# Altium project IG_r2-0.PrjPCB
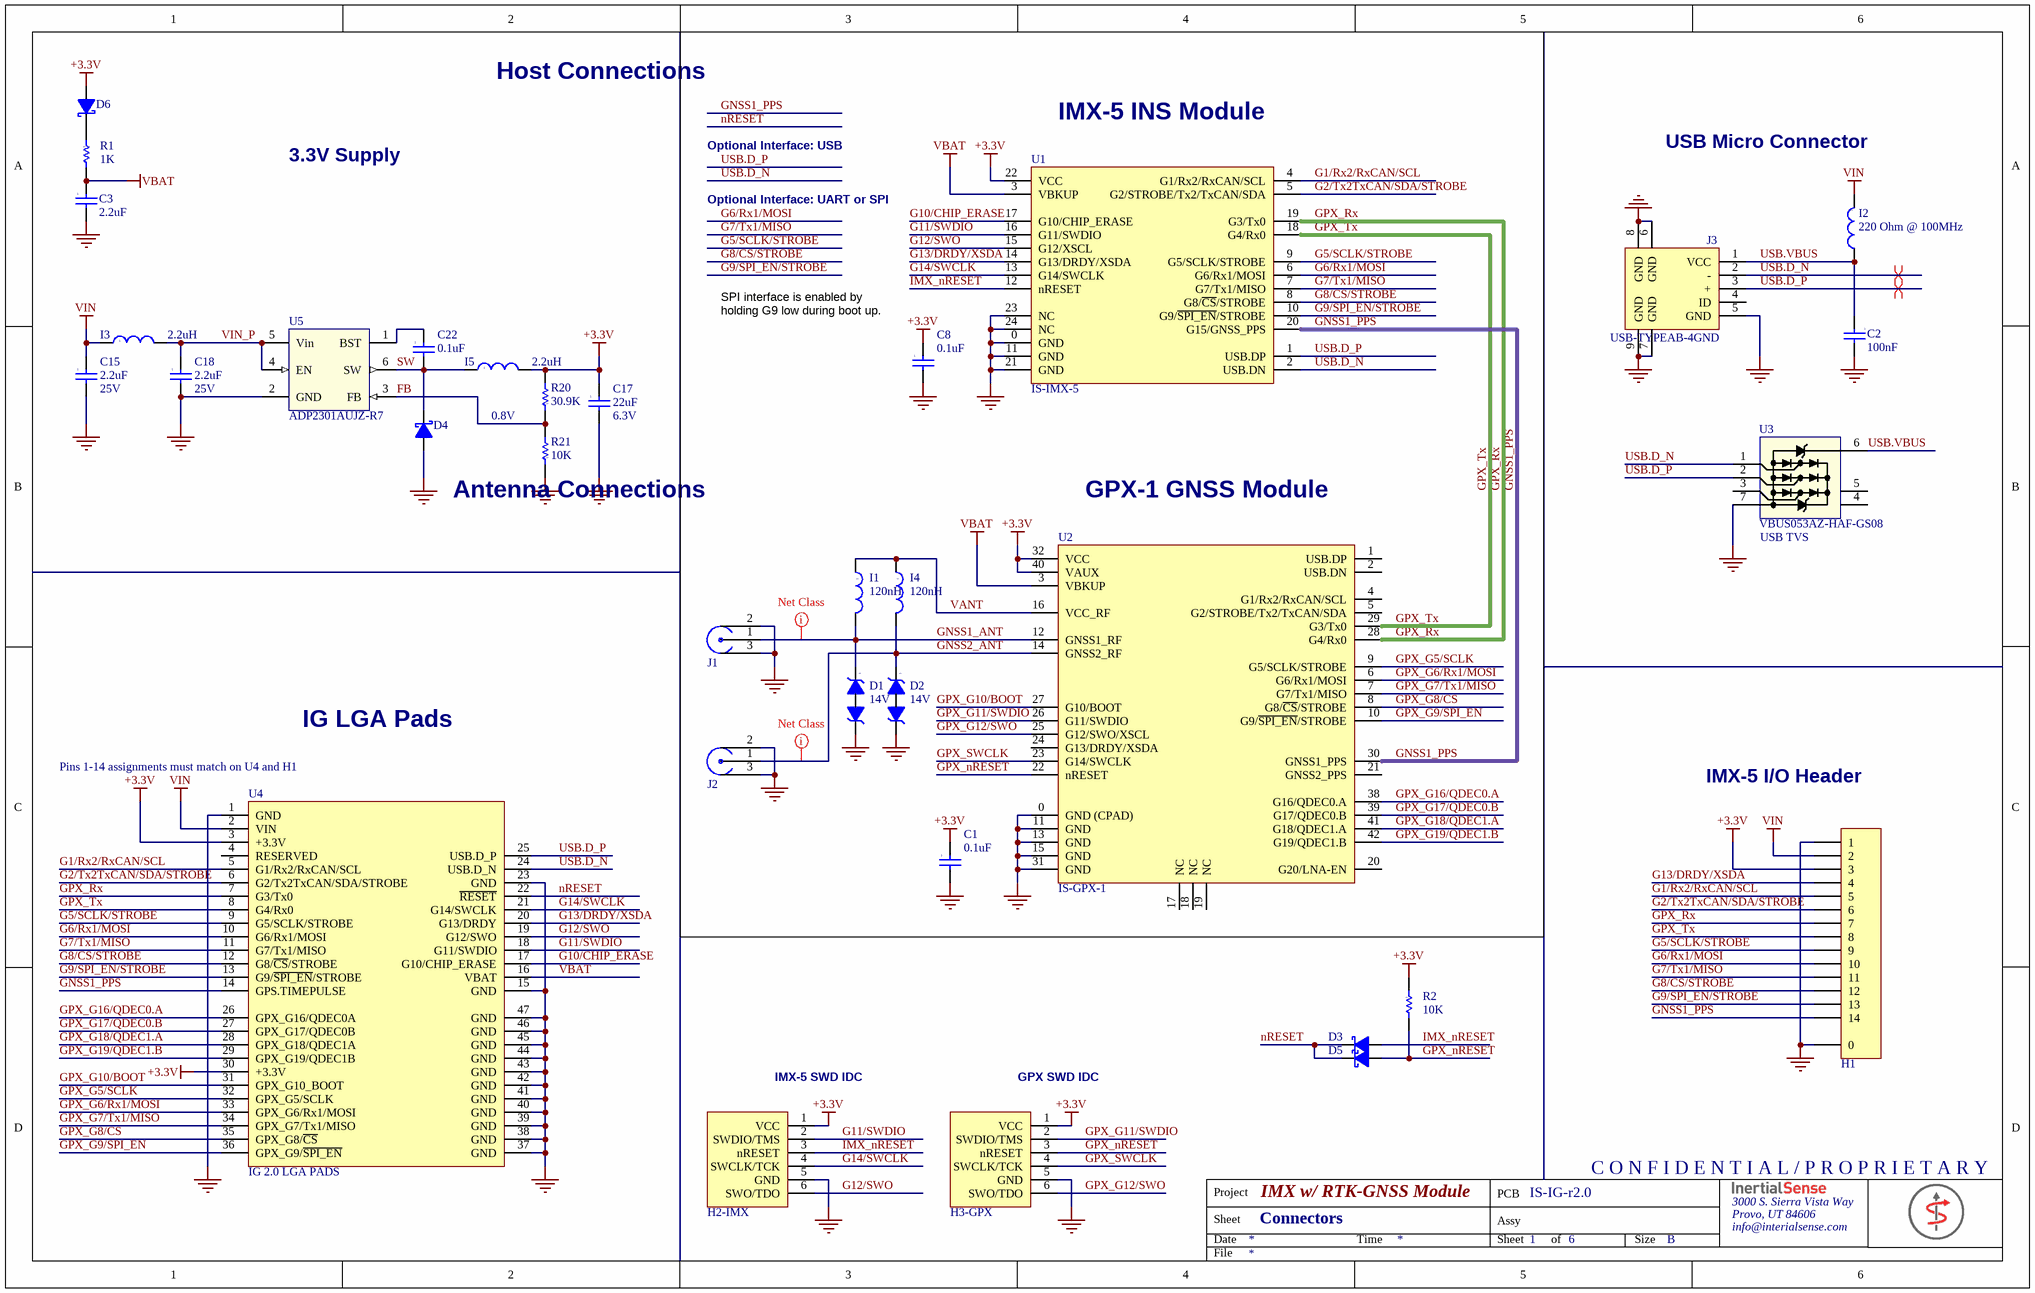
[diagram p0: Main.SchDoc]
AddressLine1: 3000 S. Sierra Vista Way; AddressLine2: Provo, UT 84606; AddressLine3: info@interialsense.com; Company: Inertial Sense, Inc.; PcbPartNumber: IS-IG-r2.0; PcbRevision: 2.0.2; ProjectTitle: IMX w/ RTK-GNSS Module
1 sheet, 34 parts. Net scope: global (net labels, ports and power ports of the same name join across sheets).
Board file: IG-2.PCBDOC

## Sheet Main.SchDoc: Connectors
size B; DocumentNumber: 1; SheetNumber: 1; SheetTotal: 6

### Parts
C1  value 0.1uF  [0402]  (hidden comment: Cap)
C2  value 100nF  [0402]  (hidden comment: Cap)
C3  value 2.2uF  [0402]  (hidden comment: Cap)
C8  value 0.1uF  [0402]  (hidden comment: Cap)
C15  value 2.2uF  Voltage Rating: 25V  [0603]  (hidden comment: Cap)
C17  value 22uF  Voltage Rating: 6.3V  [0603]  (hidden comment: Cap)
C18  value 2.2uF  Voltage Rating: 25V  [0603]  (hidden comment: Cap)
C22  value 0.1uF  [0402]  (hidden comment: Cap)
D1  Working Voltage: 14V  [R0402]  (hidden comment: Diode - Bidirectional Zener)
D2  Working Voltage: 14V  [R0402]  (hidden comment: Diode - Bidirectional Zener)
D3  Diode - Schottky  [D0402]  (value not drawn)
D4  Diode - Schottky  [D0603B]  (value not drawn)
D5  Diode - Schottky  [D0402]  (value not drawn)
D6  Diode - Schottky  [D0603B]  (value not drawn)
H1  Hdr - 14pin - mount  [SM14B-GHS-TB(LF)(SN)]  (value not drawn)
H2-IMX  TC2030-IDC  [TC2030-IDC-NL]  (value not drawn)  (no BOM)
H3-GPX  TC2030-IDC  [TC2030-IDC-NL]  (value not drawn)  (no BOM)
I1  value 120nH  [0402]  (hidden comment: Inductor)
I2  value 220 Ohm @ 100MHz  [I0603]  (hidden comment: Inductor)
I3  value 2.2uH  [0806]  (hidden comment: Inductor)
I4  value 120nH  [0402]  (hidden comment: Inductor)
I5  value 2.2uH  [0806]  (hidden comment: Inductor)
J1  RF - GND x 2  [RF UMC SMD]  (value not drawn)
J2  RF - GND x 2  [RF UMC SMD]  (value not drawn)
J3  USB-TYPEAB-4GND  [USB Micro AB R/A THR]
R1  value 1K  [R0402]  (hidden comment: Res)
R2  value 10K  [R0402]  (hidden comment: Res)
R20  value 30.9K  [R0402]  (hidden comment: Res)
R21  value 10K  [R0402]  (hidden comment: Res)
U1  Manufacturer Part Number: IS-IMX-5  [IS-IMX-5.0]  (hidden comment: IMX)
U2  Manufacturer Part Number: IS-GPX-1  [IS-GPX-1.0]  (hidden comment: GPX)
U3  Manufacturer Part Number: VBUS053AZ-HAF-GS08  [QFN50P160X160X60-6N]  (hidden comment: VBUS053)
U4  IG 2.0 LGA PADS  [IG-2.0_LGA]  (no BOM)
U5  Manufacturer Part Number: ADP2301AUJZ-R7  [MO-178-AB]  (hidden comment: ADP2301)

### Nets
+3.3V: C1.1 C8.1 C17.1 D6.A H1.3 H2-IMX.1(VCC) H3-GPX.1(VCC) I5.2 R2.1 R20.2 U1.22(VCC) U2.32(VCC) U2.40(VAUX) U4.3(+3.3V) U4.30(+3.3V)
GND: C1.2 C2.2 C3.2 C8.2 C15.2 C17.2 C18.2 D1.2 D2.2 D4.A H1.0 H1.1 H2-IMX.5(GND) H3-GPX.5(GND) J1.2 J1.3 J2.2 J2.3 J3.5(GND) J3.6(GND) J3.7(GND) J3.8(GND) J3.9(GND) R21.1 U1.0(GND) U1.11(GND) U1.21(GND) U1.23(NC) U1.24(NC) U2.0(GND_(CPAD)) U2.11(GND) U2.13(GND) U2.15(GND) U2.31(GND) U3.7 U4.1(GND) U4.15(GND) U4.23(GND) U4.37(GND) U4.38(GND) U4.39(GND) U4.40(GND) U4.41(GND) U4.42(GND) U4.43(GND) U4.44(GND) U4.45(GND) U4.46(GND) U4.47(GND) U5.2(GND)
VBAT: C3.1 R1.2 U1.3(VBKUP) U2.3(VBKUP) U4.16(VBAT)
VIN: C15.1 H1.2 I2.1 I3.1 U4.2(VIN)
FB: R20.1 R21.2 U5.3(FB)
G1/Rx2/RxCAN/SCL: H1.5 U1.4(G1/Rx2/RxCAN/SCL) U4.5(G1/Rx2/RxCAN/SCL)
G2/Tx2TxCAN/SDA/STROBE: H1.6 U1.5(G2/STROBE/Tx2/TxCAN/SDA) U4.6(G2/Tx2TxCAN/SDA/STROBE)
G5/SCLK/STROBE: H1.9 U1.9(G5/SCLK/STROBE) U4.9(G5/SCLK/STROBE)
G6/Rx1/MOSI: H1.10 U1.6(G6/Rx1/MOSI) U4.10(G6/Rx1/MOSI)
G7/Tx1/MISO: H1.11 U1.7(G7/Tx1/MISO) U4.11(G7/Tx1/MISO)
G8/~{CS}/STROBE: H1.12 U1.8(G8/~{CS}/STROBE) U4.12(G8/~{CS}/STROBE)
G9/~{SPI_EN}/STROBE: H1.13 U1.10(G9/~{SPI_EN}/STROBE) U4.13(G9/~{SPI_EN}/STROBE)
G10/CHIP_ERASE: U1.17(G10/CHIP_ERASE) U4.17(G10/CHIP_ERASE)
G11/SWDIO: H2-IMX.2(SWDIO/TMS) U1.16(G11/SWDIO) U4.18(G11/SWDIO)
G12/SWO: H2-IMX.6(SWO/TDO) U1.15(G12/XSCL) U4.19(G12/SWO)
G13/DRDY/XSDA: H1.4 U1.14(G13/DRDY/XSDA) U4.20(G13/DRDY)
G14/SWCLK: H2-IMX.4(SWCLK/TCK) U1.13(G14/SWCLK) U4.21(G14/SWCLK)
GNSS1_ANT: D1.1 I1.2 J1.1 U2.12(GNSS1_RF)
GNSS1_PPS: H1.14 U1.20(G15/GNSS_PPS) U2.30(GNSS1_PPS) U4.14(GPS.TIMEPULSE)
GNSS2_ANT: D2.1 I4.2 J2.1 U2.14(GNSS2_RF)
GPX_G5/SCLK: U2.9(G5/SCLK/STROBE) U4.32(GPX_G5/SCLK)
GPX_G6/Rx1/MOSI: U2.6(G6/Rx1/MOSI) U4.33(GPX_G6/Rx1/MOSI)
GPX_G7/Tx1/MISO: U2.7(G7/Tx1/MISO) U4.34(GPX_G7/Tx1/MISO)
GPX_G8/~{CS}: U2.8(G8/~{CS}/STROBE) U4.35(GPX_G8/~{CS})
GPX_G9/~{SPI_EN}: U2.10(G9/~{SPI_EN}/STROBE) U4.36(GPX_G9/~{SPI_EN})
GPX_G10/BOOT: U2.27(G10/BOOT) U4.31(GPX_G10_BOOT)
GPX_G11/SWDIO: H3-GPX.2(SWDIO/TMS) U2.26(G11/SWDIO)
GPX_G12/SWO: H3-GPX.6(SWO/TDO) U2.25(G12/SWO/XSCL)
GPX_G16/QDEC0.A: U2.38(G16/QDEC0.A) U4.26(GPX_G16/QDEC0A)
GPX_G17/QDEC0.B: U2.39(G17/QDEC0.B) U4.27(GPX_G17/QDEC0B)
GPX_G18/QDEC1.A: U2.41(G18/QDEC1.A) U4.28(GPX_G18/QDEC1A)
GPX_G19/QDEC1.B: U2.42(G19/QDEC1.B) U4.29(GPX_G19/QDEC1B)
GPX_nRESET: D5.A H3-GPX.3(nRESET) R2.2 U2.22(nRESET)
GPX_Rx: H1.7 U1.19(G3/Tx0) U2.28(G4/Rx0) U4.7(G3/Tx0)
GPX_SWCLK: H3-GPX.4(SWCLK/TCK) U2.23(G14/SWCLK)
GPX_Tx: H1.8 U1.18(G4/Rx0) U2.29(G3/Tx0) U4.8(G4/Rx0)
IMX_nRESET: D3.A H2-IMX.3(nRESET) U1.12(nRESET)
nRESET: D3.C D5.C U4.22(~{RESET})
SW: C22.2 D4.C I5.1 U5.6(SW)
USB.D_N: J3.2(-) U1.2(USB.DN) U3.1 U4.24(USB.D_N)
USB.D_P: J3.3(+) U1.1(USB.DP) U3.2 U4.25(USB.D_P)
USB.VBUS: C2.1 I2.2 J3.1(VCC) U3.6
VANT: I1.1 I4.1 U2.16(VCC_RF)
VIN_P: C18.1 I3.2 U5.4(EN) U5.5(Vin)
NetC22_1: C22.1 U5.1(BST)
NetD6_C: D6.C R1.1

Not connected (* = marked no-connect by the designer): J3 4(ID); U2 1(USB.DP) 2(USB.DN) 4(G1/Rx2/RxCAN/SCL) 5(G2/STROBE/Tx2/TxCAN/SDA) 17(NC) 18(NC) 19(NC) 20(G20/LNA-EN) 21(GNSS2_PPS) 24(G13/DRDY/XSDA); U3 3 4(nc) 5(nc); U4 4(RESERVED)

### Layout directives
differential pair; differential pair class USB: USB.D_N, USB.D_P
net class RF_GPS: GNSS1_ANT, GNSS2_ANT

### Notes on the sheet
- Host Connections
- 3.3V Supply
- Optional Interface: USB
- IMX-5 INS Module
- USB Micro Connector
- Optional Interface: UART or SPI
- (near C8) SPI interface is enabled by holding G9 low during boot up.
- 0.8V
- Antenna Connections
- GPX-1 GNSS Module
- (near U3) USB TVS
- (near U4) Pins 1-14 assignments must match on U4 and H1
- IG LGA Pads
- IMX-5 I/O Header
- (near H2-IMX) IMX-5 SWD IDC
- (near H3-GPX) GPX SWD IDC
- C O N F I D E N T I A L / P R O P R I E T A R Y
- Date
- Sheet
- Project
- Time
- PCB
- Assy
- of
- Size
- B
- File

### Library data of the parts
C1 C2 C8 = Cap: CAP CER .10UF 50V X7R 10% 0402; Manufacturer: TDK Corporation; Manufacturer Part Number: C1005X7R1H104K; Capacitance: 0.1µF; Published: 8-Jun-2000; LatestRevisionDate: 17-Jul-2002; LatestRevisionNote: Re-released for DXP Platform.; Publisher: Altium Limited; Category: Capacitors; Supplier 1: Digi-Key; Supplier Part Number 1: 445-5932-1-ND; RoHS: RoHS Compliant; Stock 1: 174080; Pricing 1: 1=0.3, 10=0.2, 100=0.08, 250=0.05752, 500=0.041, 1000=0.03 (USD); Voltage - Rated: 50V; Tolerance: ±10%; Temperature Coefficient: X7R; Mounting Type: Surface Mount, MLCC; Operating Temperature: -55°C ~ 125°C; Applications: General Purpose; Ratings: -; Package / Case: 0402 (1005 Metric); Size / Dimension: 0.039" L x 0.020" W (1.00mm x 0.50mm); Height: -; Thickness: 0.022" (0.55mm); Lead Spacing: -; Features: -; Packaging: Cut Tape (CT); Lead Style: -; ComponentLink1URL: http://www.tdk.co.jp/tefe02/e412_c.pdf; ComponentLink1Description: http://www.tdk.co.jp/tefe02/e412_c.pdf
C3 = Cap: 0402 2.2 uF 6.3 V ±10% Tolerance X6S Multilayer Ceramic Capacitor; Manufacturer: Murata; Manufacturer Part Number: GRM155C80J225KE95D; Voltage Rating: 6.3V; Published: 8-Jun-2000; LatestRevisionDate: 17-Jul-2002; LatestRevisionNote: Re-released for DXP Platform.; Publisher: Altium Limited; Category: Capacitors; Supplier: Digi-Key; Supplier Part Number: 490-10012-2-ND; RoHS: Yes; Stock: 7200000; Pricing: 10000=0.01548, 20000=0.01475, 30000=0.01401, 50000=0.01253, 100000=0.01014, 250000=0.00922 (USD); Mounting Technology: Surface Mount; Case/Package: 0402; Case Code (Metric): 1005; Material: Ceramic; Case Code (Imperial): 0402; Min Operating Temperature: -55°C; Max Operating Temperature: 105°C; Tolerance: 10%; Packaging: Cut Tape; Voltage Rating (DC): 6.3V; Series: GRM; Length: 0.039inch; Width: 0.02inch; Height: 0.3mm; Thickness: 0.022inch; RoHS Compliant: Yes; ComponentLink1URL: http://search.murata.co.jp/Ceramy/image/img/A01X/G101/ENG/GRM155C80J225KE95-01.pdf?src-supplier=Digi-Key; ComponentLink1Description: http://search.murata.co.jp/Ceramy/image/img/A01X/G101/ENG/GRM155C80J225KE95-01.pdf?src-supplier=Digi-Key; ComponentLink2URL: http://search.murata.co.jp/Ceramy/image/img/A01X/partnumbering_e_01.pdf?src-supplier=Digi-Key; ComponentLink2Description: http://search.murata.co.jp/Ceramy/image/img/A01X/partnumbering_e_01.pdf?src-supplier=Digi-Key
C15 C18 = Cap: CAP CER 2.2UF 25V X6S 0603; Manufacturer: Murata; Manufacturer Part Number: GRT188C81E225KE13D; Tolerance: 10%; Published: 8-Jun-2000; LatestRevisionDate: 17-Jul-2002; LatestRevisionNote: Re-released for DXP Platform.; Publisher: Altium Limited; Category: Capacitors; Supplier 1: Digi-Key; Supplier Part Number 1: 490-12293-6-ND; Stock 1: 16854; Pricing 1: 1=0.35, 10=0.239, 100=0.1355, 500=0.09564, 1000=0.08369 (USD); Mount: Surface Mount; Case/Package: 0603; Case Code (Metric): 1608; Case Code (Imperial): 0603; Min Operating Temperature: -55°C; Max Operating Temperature: 105°C; Packaging: Tape and Reel; Capacitance: 2.2uF; Dielectric: X6S; Voltage Rating (DC): 25V; Length: 0.063inch; Width: 0.031inch; Thickness: 0.035inch; ComponentLink1URL: http://www.farnell.com/datasheets/2165949.pdf; ComponentLink1Description: http://www.farnell.com/datasheets/2165949.pdf; ComponentLink2URL: http://search.murata.co.jp/Ceramy/image/img/A01X/G101/ENG/GRT188C81E225KE13-01.pdf; ComponentLink2Description: http://search.murata.co.jp/Ceramy/image/img/A01X/G101/ENG/GRT188C81E225KE13-01.pdf
C17 = Cap: CAP CER 22UF 6.3V X6S 0603; Manufacturer: Murata; Manufacturer Part Number: GRM188C80J226ME15D; Tolerance: 20%; Published: 8-Jun-2000; LatestRevisionDate: 17-Jul-2002; LatestRevisionNote: Re-released for DXP Platform.; Publisher: Altium Limited; Category: Capacitors; Supplier 1: Digi-Key; Supplier Part Number 1: 490-10471-6-ND; Stock 1: 0; Pricing 1: 1=0.25, 10=0.168, 100=0.0955, 500=0.0674, 1000=0.05897 (USD); Mount: Surface Mount; Case/Package: 0603; Weight: 0.000222oz; Case Code (Metric): 1608; Case Code (Imperial): 0603; Min Operating Temperature: -55°C; Max Operating Temperature: 105°C; Capacitance: 22uF; Packaging: Tape and Reel; Dielectric: X6S; Termination: SMD/SMT; Voltage Rating (DC): 6.3V; Package Quantity: 4000; Length: 0.063inch; Height: 0.8mm; Width: 0.8mm; Thickness: 0.039inch; Lead Free: Lead Free; ComponentLink1URL: http://www.mouser.com/ds/2/281/c02e-2905.pdf; ComponentLink1Description: http://www.mouser.com/ds/2/281/c02e-2905.pdf; ComponentLink2URL: http://search.murata.co.jp/Ceramy/image/img/A01X/partnumbering_e_01.pdf; ComponentLink2Description: http://search.murata.co.jp/Ceramy/image/img/A01X/partnumbering_e_01.pdf
C22 = Cap: CAP CER 0.1UF 50V X7R 0402; Manufacturer: TDK; Manufacturer Part Number: CGA2B3X7R1H104K050BB; Tolerance: 10%; Published: 8-Jun-2000; LatestRevisionDate: 17-Jul-2002; LatestRevisionNote: Re-released for DXP Platform.; Publisher: Altium Limited; Category: Capacitors; Supplier 1: Digi-Key; Supplier Part Number 1: 445-6899-1-ND; Stock 1: 12402793; Pricing 1: 1=0.16000, 10=0.11700, 100=0.05500, 500=0.03858, 1000=0.03194, 2500=0.02973, 5000=0.02720 (USD); RoHS: Yes; Mount: Surface Mount; Case/Package: 0402; Weight: 2.3E-05oz; Case Code (Metric): 1005; Case Code (Imperial): 0402; Min Operating Temperature: -55°C; Max Operating Temperature: 125°C; Voltage Rating: 50V; Capacitance: 0.1uF; Packaging: Tape and Reel; Voltage Rating (DC): 50V; Dielectric: X7R; Termination: SMD/SMT; Package Quantity: 1; Composition: Ceramic; Voltage: 50V; Length: 1mm; Height: 0.5mm; Depth: 0.5mm; Width: 0.02inch; Thickness: 0.022inch; Ratings: AEC-Q200; Lead Free: Lead Free; REACH SVHC: No SVHC; ComponentLink1URL: https://datasheet.ciiva.com/16498/mlccspec-automotive-general-midvoltage-en-16498528.pdf?src-supplier=Future+Electronics; ComponentLink1Description: https://datasheet.ciiva.com/16498/mlccspec-automotive-general-midvoltage-en-16498528.pdf?src-supplier=Future+Electronics; ComponentLink2URL: https://datasheet.ciiva.com/24216/cga2b3x7r1h104k050bb-266281-24216070.pdf?src-supplier=Mouser; ComponentLink2Description: https://datasheet.ciiva.com/24216/cga2b3x7r1h104k050bb-266281-24216070.pdf?src-supplier=Mouser; ComponentLink3URL: https://datasheet.ciiva.com/7975/1788388-7975306.pdf?src-supplier=Element14; ComponentLink3Description: https://datasheet.ciiva.com/7975/1788388-7975306.pdf?src-supplier=Element14; ComponentLink4URL: https://datasheet.ciiva.com/22703/1807242-22703013.pdf?src-supplier=Element14; ComponentLink4Description: https://datasheet.ciiva.com/22703/1807242-22703013.pdf?src-supplier=Element14; ComponentLink5URL: https://datasheet.ciiva.com/22725/1735392-22725627.pdf?src-supplier=Element14; ComponentLink5Description: https://datasheet.ciiva.com/22725/1735392-22725627.pdf?src-supplier=Element14
D1 D2 = Diode - Bidirectional Zener: LITTELFUSE - PESD0402-140 - DIODE, ESD PROTECTION, 0402, FULL REEL; Clamping Voltage: 40V; Number of Bidirectional Channels: 1; Power Line Protection: No; Turn-On Delay Time: 1ns; Supplier 1: Digi-Key; Supplier Part Number 1: PESD0402-140CT-ND; Manufacturer: Littelfuse; Manufacturer Part Number: PESD0402-140; RoHS: No; Category: TVS Diodes; Stock 1: 211482; Pricing 1: 1=0.40000, 10=0.32100, 100=0.22900, 500=0.17400, 1000=0.13737, 2000=0.13279, 5000=0.12821 (USD); Mount: Surface Mount; Case/Package: 0402; Number of Pins: 2; Min Operating Temperature: -55°C; Max Operating Temperature: 125°C; Packaging: Tape and Reel; Direction: Bidirectional; Reverse Standoff Voltage: 14V; Resistor Type: Zener; Operating Supply Voltage: 14V; Lead Free: Lead Free; REACH SVHC: Unknown; ComponentLink1URL: https://datasheet.ciiva.com/58684/-58684341.pdf?src-supplier=Digi-Key; ComponentLink1Description: https://datasheet.ciiva.com/58684/-58684341.pdf?src-supplier=Digi-Key
D3 D5 = Diode - Schottky: CDBQR0130L; SMT Schottky Diode; 35V 100mA; 2-Pin SOD-923F (0402); Manufacturer: Comchip; Max Surge Current: 1A; Max Reverse Leakage Current: 10uA; Max Reverse Voltage (DC): 30V; Supplier: Digi-Key; Supplier Part Number: 641-1271-2-ND; Manufacturer Part Number: CDBQR0130L; RoHS: Yes; Category: Rectifier Diodes; Stock: 645000; Pricing: 5000=0.05980, 10000=0.05083, 25000=0.04784, 50000=0.04485, 125000=0.03887 (USD); Mounting Technology: Surface Mount; Case/Package: 0402; Case Code (Metric): 1005; Case Code (Imperial): 0402; Package Quantity: 1; Packaging: Tape and Reel; Average Rectified Current: 100mA; RoHS Compliant: Yes
  D3: ComponentLink1URL: https://datasheet.ciiva.com/913/cdbqr0130l-revb795355-913009.pdf?src-supplier=Digi-Key; ComponentLink1Description: https://datasheet.ciiva.com/913/cdbqr0130l-revb795355-913009.pdf?src-supplier=Digi-Key; ComponentLink2URL: https://datasheet.ciiva.com/4716/cdbqr0130l-revb795355-33189-4716003.pdf?src-supplier=Mouser; ComponentLink2Description: https://datasheet.ciiva.com/4716/cdbqr0130l-revb795355-33189-4716003.pdf?src-supplier=Mouser; ComponentLink3URL: https://datasheet.ciiva.com/913/cdbqr0130l-revb795355-913010.pdf?src-supplier=Digi-Key; ComponentLink3Description: https://datasheet.ciiva.com/913/cdbqr0130l-revb795355-913010.pdf?src-supplier=Digi-Key; ComponentLink4URL: https://datasheet.ciiva.com/913/cdbqr0130l-revb795355-913011.pdf?src-supplier=Digi-Key; ComponentLink4Description: https://datasheet.ciiva.com/913/cdbqr0130l-revb795355-913011.pdf?src-supplier=Digi-Key
  D5: ComponentLink1URL: https://datasheet.ciiva.com/8301/bas70lp-8301585.pdf?src-supplier=Avnet; ComponentLink1Description: https://datasheet.ciiva.com/8301/bas70lp-8301585.pdf?src-supplier=Avnet; ComponentLink2URL: https://datasheet.ciiva.com/26949/getdatasheetpartid-661958-26949407.pdf?src-supplier=Verical; ComponentLink2Description: https://datasheet.ciiva.com/26949/getdatasheetpartid-661958-26949407.pdf?src-supplier=Verical; ComponentLink3URL: https://datasheet.ciiva.com/18567/bas70lp-18567705.pdf?src-supplier=Digi-Key; ComponentLink3Description: https://datasheet.ciiva.com/18567/bas70lp-18567705.pdf?src-supplier=Digi-Key; ComponentLink4URL: https://datasheet.ciiva.com/16418/bas70lp-16418375.pdf?src-supplier=Future+Electronics; ComponentLink4Description: https://datasheet.ciiva.com/16418/bas70lp-16418375.pdf?src-supplier=Future+Electronics; ComponentLink5URL: https://datasheet.ciiva.com/913/cdbqr0130l-revb795355-913009.pdf?src-supplier=Digi-Key; ComponentLink5Description: https://datasheet.ciiva.com/913/cdbqr0130l-revb795355-913009.pdf?src-supplier=Digi-Key; ComponentLink6URL: https://datasheet.ciiva.com/4716/cdbqr0130l-revb795355-33189-4716003.pdf?src-supplier=Mouser; ComponentLink6Description: https://datasheet.ciiva.com/4716/cdbqr0130l-revb795355-33189-4716003.pdf?src-supplier=Mouser; ComponentLink7URL: https://datasheet.ciiva.com/913/cdbqr0130l-revb795355-913010.pdf?src-supplier=Digi-Key; ComponentLink7Description: https://datasheet.ciiva.com/913/cdbqr0130l-revb795355-913010.pdf?src-supplier=Digi-Key; ComponentLink8URL: https://datasheet.ciiva.com/913/cdbqr0130l-revb795355-913011.pdf?src-supplier=Digi-Key; ComponentLink8Description: https://datasheet.ciiva.com/913/cdbqr0130l-revb795355-913011.pdf?src-supplier=Digi-Key
D4 D6 = Diode - Schottky: DIODE SCHOTTKY 30V 2A 0603; Manufacturer: Vishay; Manufacturer Part Number: VSKY20301608-G4-08; Supplier 1: Digi-Key; Supplier Part Number 1: VSKY20301608-G4-08GICT-ND; Stock 1: 13064; Pricing 1: 1=0.38, 10=0.305, 25=0.2792, 100=0.2076, 250=0.1882, 500=0.15574, 1000=0.1168, 2500=0.10707 (USD); ComponentLink1URL: http://www.mouser.com/ds/2/427/vsky20301608-777242.pdf; ComponentLink1Description: http://www.mouser.com/ds/2/427/vsky20301608-777242.pdf
H1 = Hdr - 14pin - mount: Conn Shrouded Header HDR 14 POS 1.25mm Solder ST Top Entry SMD T/R; Manufacturer: JST; Supplier 1: Digi-Key; Supplier Part Number 1: 455-1576-2-ND; Manufacturer Part Number: SM14B-GHS-TB(LF)(SN); RoHS: No; Category: Connectors; Pricing 1: 2500=0.35044, 5000=0.33876, 12500=0.31072, 25000=0.30371 (USD)
H2-IMX H3-GPX = TC2030-IDC: 6 pin header
I1 I4 = Inductor: Inductor RF Chip Wirewound 120nH 5% 100MHz 20Q-Factor 110mA 2.66Ohm DCR 0402 Paper T/R; Manufacturer: Murata; Manufacturer Part Number: LQW15ANR12J00D; Core Material: Air,Ferrite; DC Resistance (DCR): 2.66R; Shielding: Unshielded; Self Resonant Frequency: 1GHz; ComponentLink1URL: http://search.murata.co.jp/Ceramy/image/img/PDF/ENG/L0075S0083LQG15HS.pdf; ComponentLink1Description: http://search.murata.co.jp/Ceramy/image/img/PDF/ENG/L0075S0083LQG15HS.pdf; Supplier 1: Digi-Key; Supplier Part Number 1: 490-4091-1-ND; RoHS: Yes; Category: Fixed Inductors; Stock 1: 2053; Pricing 1: 1=0.15000, 10=0.13500, 25=0.12000, 50=0.10200, 100=0.09000, 250=0.08252, 500=0.07500, 1000=0.06300, 2500=0.05400 (USD); Mount: Surface Mount; Case/Package: 0402; Number of Pins: 2; Case Code (Imperial): 0402; Weight: 2.8E-05oz; Case Code (Metric): 1005; Min Operating Temperature: -55°C; Max Operating Temperature: 125°C; Tolerance: 5%; Inductance: 120nH; Max DC Current: 110mA; Packaging: Tape and Reel; Inductance Tolerance: 5%; Package Quantity: 10000; Current Rating: 110mA; Test Frequency: 100MHz; Termination: SMD/SMT; DC Current: 110mA; Length: 1mm; Width: 0.02inch; Height: 0.5mm; Depth: 0.6mm; Radiation Hardening: No; Lead Free: Lead Free; Military Standard: Not; REACH SVHC: No SVHC; ComponentLink2URL: https://datasheet.ciiva.com/11799/0900766b8090d800-11799096.pdf?src-supplier=RSComponents; ComponentLink2Description: https://datasheet.ciiva.com/11799/0900766b8090d800-11799096.pdf?src-supplier=RSComponents; ComponentLink3URL: https://datasheet.ciiva.com/1042/l0075s0080lqw15a-00-1042180.pdf?src-supplier=Digi-Key; ComponentLink3Description: https://datasheet.ciiva.com/1042/l0075s0080lqw15a-00-1042180.pdf?src-supplier=Digi-Key; ComponentLink4URL: https://datasheet.ciiva.com/1042/l0075s0080lqw15a-00-1042181.pdf?src-supplier=Digi-Key; ComponentLink4Description: https://datasheet.ciiva.com/1042/l0075s0080lqw15a-00-1042181.pdf?src-supplier=Digi-Key; ComponentLink5URL: https://datasheet.ciiva.com/1042/l0075s0080lqw15a-00-1042182.pdf?src-supplier=Digi-Key; ComponentLink5Description: https://datasheet.ciiva.com/1042/l0075s0080lqw15a-00-1042182.pdf?src-supplier=Digi-Key; ComponentLink6URL: https://datasheet.ciiva.com/16207/l0075s0080lqw15a-00-16207819.pdf?src-supplier=Future+Electronics; ComponentLink6Description: https://datasheet.ciiva.com/16207/l0075s0080lqw15a-00-16207819.pdf?src-supplier=Future+Electronics; ComponentLink7URL: https://datasheet.ciiva.com/8506/l0075s0080lqw15a-00-8506030.pdf?src-supplier=Avnet; ComponentLink7Description: https://datasheet.ciiva.com/8506/l0075s0080lqw15a-00-8506030.pdf?src-supplier=Avnet
I2 = Inductor: FERRITE CHIP 220 OHM 2500MA 0603; Manufacturer: Murata Electronics North America; Manufacturer Part Number: BLM18SG221TN1D; Current Rating: 2.5A; DC Resistance (DCR): 40 mOhm Max; Filter Type: Differential Mode - Single; Supplier 1: Digi-Key; Supplier Part Number 1: 490-5225-1-ND; RoHS: RoHS Compliant; Category: Filters; Stock 1: 146728; Pricing 1: 1=0.14, 10=0.116, 50=0.075, 100=0.0646, 250=0.05172, 500=0.04654, 1000=0.03878, 5000=0.03619 (USD); Packaging: Cut Tape (CT); Impedance @ Frequency: 220 Ohm @ 100MHz; Package / Case: 0603 (1608 Metric); Mounting Type: Surface Mount; Height (Max): 0.037" (0.95mm); Size / Dimension: 0.063" L x 0.031" W (1.60mm x 0.80mm); ComponentLink1URL: http://search.murata.co.jp/Ceramy/image/img/PDF/ENG/L0110S0100BLM18S.pdf; ComponentLink1Description: http://search.murata.co.jp/Ceramy/image/img/PDF/ENG/L0110S0100BLM18S.pdf
I3 I5 = Inductor: FIXED IND 2.2UH 1.2A 110 MOHM; Manufacturer: TDK; Manufacturer Part Number: MLP2016H2R2MT0S1; Core Material: Ferrite; Tolerance: 20%; Shielding: Unshielded; DC Resistance (DCR): 137.5mR; Test Frequency: 2MHz; Supplier 1: Digi-Key; Supplier Part Number 1: 445-15724-6-ND; Stock 1: 14048; Pricing 1: 1=0.38, 10=0.335, 100=0.2302, 500=0.19674, 1000=0.1507 (USD); Mount: Surface Mount; Case/Package: 0806; Case Code (Metric): 2016; Case Code (Imperial): 0806; Min Operating Temperature: -40°C; Max Operating Temperature: 125°C; Package Quantity: 3000; Packaging: Tape and Reel; Current Rating: 1.2A; Inductance: 2.2uh; Length: 0.079inch; Width: 0.063inch; Height - Seated (Max): 0.039inch; Lead Free: Lead Free; ComponentLink1URL: https://datasheet.ciiva.com/29697/inductor-commercial-power-mlp-en-29697725.pdf; ComponentLink1Description: https://datasheet.ciiva.com/29697/inductor-commercial-power-mlp-en-29697725.pdf; ComponentLink2URL: https://datasheet.ciiva.com/29697/inductor-commercial-power-mlp-en-29697726.pdf; ComponentLink2Description: https://datasheet.ciiva.com/29697/inductor-commercial-power-mlp-en-29697726.pdf
J1 J2 = RF - GND x 2: CONN UMC RCPT STR 50 OHM SMD; Manufacturer: Emerson Network Power Connectivity Johnson; Manufacturer Part Number: 128-0711-201; Connector Style: Ultra Miniature Coaxial; Connector Type: Receptacle, Male Pins; Contact Termination: Solder; Impedance: 50 Ohm; Frequency - Max: 6GHz; Body Finish: Gold; Voltage Rating: 200V; Supplier 1: Digi-Key; Supplier Part Number 1: J983CT-ND; RoHS: RoHS Compliant; Category: Connectors, Interconnects; Stock 1: 1514; Pricing 1: 1=0.93, 10=0.832, 50=0.784, 100=0.672, 250=0.576, 500=0.544, 750=0.48, 1000=0.448 (USD); Packaging: Cut Tape (CT); Shield Termination: Solder; Mounting Type: Surface Mount; Cable Group: -; Fastening Type: Snap-On; Features: -; Housing Color: Gold; Ingress Protection: -; Body Material: -; Center Contact Material: -; Center Contact Plating: Gold; Dielectric Material: -; Operating Temperature: -40°C ~ 90°C; ComponentLink1URL: http://media.digikey.com/pdf/Data%20Sheets/Emerson%20PDFs/UMC%20Product%20Catalog.pdf; ComponentLink1Description: http://media.digikey.com/pdf/Data%20Sheets/Emerson%20PDFs/UMC%20Product%20Catalog.pdf
J3 = USB-TYPEAB-4GND: CONN USB AB 4POS; Manufacturer: Amphenol FCI; Manufacturer Part Number: 10118194-0001LF; Gender: Receptacle; Current Rating: 1.8A; Connector Type: USB,Receptacle; Number of Contacts: 5; Insulation Resistance: 1GR; Number of Ports: 1; Max Voltage Rating (AC): 100V; Pitch: 0.65mm; Supplier 1: Digi-Key; Supplier Part Number 1: 609-4618-1-ND; Stock 1: 77572; Pricing 1: 1=0.48, 10=0.447, 25=0.402, 50=0.3574, 100=0.3424, 250=0.31264, 500=0.29776 (USD); Mount: Surface Mount,Horizontal; Contact Material: Copper Alloy; Contact Plating: Gold; Number of Terminals: 5; Housing Material: Polymer; Colour: Black; Min Operating Temperature: -55°C; Max Operating Temperature: 85°C; Package Quantity: 9600; Packaging: Tape and Reel; Termination: Solder; Orientation: Right Angle; Features: Shielded; Length: 8.05mm; Depth: 5mm; Radiation Hardening: No; Lead Free: Lead Free; Flammability Rating: UL94 V-0; ComponentLink1URL: https://datasheet.ciiva.com/851/10118194-851110.pdf; ComponentLink1Description: https://datasheet.ciiva.com/851/10118194-851110.pdf; ComponentLink2URL: https://datasheet.ciiva.com/851/10118194-851111.pdf; ComponentLink2Description: https://datasheet.ciiva.com/851/10118194-851111.pdf; ComponentLink3URL: https://datasheet.ciiva.com/4598/10118194ac-197217-4598807.pdf; ComponentLink3Description: https://datasheet.ciiva.com/4598/10118194ac-197217-4598807.pdf; ComponentLink4URL: https://datasheet.ciiva.com/29907/10118194-29907230.pdf; ComponentLink4Description: https://datasheet.ciiva.com/29907/10118194-29907230.pdf; ComponentLink5URL: https://datasheet.ciiva.com/26945/getdatasheetpartid-418619-26945695.pdf; ComponentLink5Description: https://datasheet.ciiva.com/26945/getdatasheetpartid-418619-26945695.pdf
R1 = Res: 1 kOhms ¡À1% 0.063W, 1/16W Chip Resistor 0402 (1005 Metric) Moisture Resistant Thick Film; Manufacturer: Yageo; Manufacturer Part Number: RC0402FR-071KL; Tolerance: 1%; Temperature Coefficient: 100ppm/°C; Power Rating: 62.5mW; Voltage Rating: 50V; Max Power Dissipation: 63mW; Supplier: Digi-Key; Supplier Part Number: 311-1.00KLRTR-ND; RoHS: Yes; Category: Chip SMD Resistors; Stock: 29757748; Pricing: 10000=0.00261, 20000=0.00231, 30000=0.00216, 50000=0.00199, 100000=0.00179 (USD); Case/Package: 0402; Pins: 2; Case Code (Imperial): 0402; Case Code (Metric): 1005; Min Operating Temperature: -55°C; Max Operating Temperature: 155°C; Resistor Type: Thick Film; Packaging: Tape and Reel; Voltage Rating (DC): 50V; Termination: SMD/SMT; Features: Moisture Resistant; Series: RC; Number of Terminations: 2; Resistance Tolerance: 1%; Construction: Rectangular; Technology: THICK FILM; Length: 1mm; Width: 0.5mm; Height: 0.32mm; Depth: 0.5mm; RoHS Compliant: Yes; Reach SVHC Compliant: No; Military Standard: Not; Lead Free: Lead Free; ComponentLink1URL: https://datasheet.ciiva.com/11819/0900766b80c66297-11819477.pdf?src-supplier=Rs; ComponentLink1Description: https://datasheet.ciiva.com/11819/0900766b80c66297-11819477.pdf?src-supplier=Rs; ComponentLink2URL: https://datasheet.ciiva.com/7983/1018594-7983502.pdf?src-supplier=Element14; ComponentLink2Description: https://datasheet.ciiva.com/7983/1018594-7983502.pdf?src-supplier=Element14; ComponentLink3URL: https://datasheet.ciiva.com/22747/1018594-22747513.pdf?src-supplier=Element14; ComponentLink3Description: https://datasheet.ciiva.com/22747/1018594-22747513.pdf?src-supplier=Element14; ComponentLink4URL: https://datasheet.ciiva.com/12666/pyu-rc0402-51-rohs-l-6-r-12666741.pdf?src-supplier=Mouser; ComponentLink4Description: https://datasheet.ciiva.com/12666/pyu-rc0402-51-rohs-l-6-r-12666741.pdf?src-supplier=Mouser; ComponentLink5URL: https://datasheet.ciiva.com/7849/1018594-7849869.pdf?src-supplier=Element14; ComponentLink5Description: https://datasheet.ciiva.com/7849/1018594-7849869.pdf?src-supplier=Element14; ComponentLink6URL: https://datasheet.ciiva.com/7849/1018594-7849871.pdf?src-supplier=Element14; ComponentLink6Description: https://datasheet.ciiva.com/7849/1018594-7849871.pdf?src-supplier=Element14; ComponentLink7URL: https://datasheet.ciiva.com/17063/pyu-rc0402-51-rohs-l-6-r-17063193.pdf?src-supplier=Future+Electronics; ComponentLink7Description: https://datasheet.ciiva.com/17063/pyu-rc0402-51-rohs-l-6-r-17063193.pdf?src-supplier=Future+Electronics
R2 = Res: 1 kOhms ¡À1% 0.063W, 1/16W Chip Resistor 0402 (1005 Metric) Moisture Resistant Thick Film; Manufacturer: Stackpole Electronics; Manufacturer Part Number: RMCF0402FT10K0; Tolerance: 1%; Temperature Coefficient: 100ppm/°C; Power Rating: 62.5mW; Voltage Rating: 50V; Max Power Dissipation: 63mW; Supplier: Digi-Key; Supplier Part Number: RMCF0402FT10K0TR-ND; RoHS: Yes; Category: Chip SMD Resistors; Stock: 29757748; Pricing: 10000=0.00261, 20000=0.00231, 30000=0.00216, 50000=0.00199, 100000=0.00179 (USD); Case/Package: 0402; Pins: 2; Case Code (Imperial): 0402; Case Code (Metric): 1005; Min Operating Temperature: -55°C; Max Operating Temperature: 155°C; Resistor Type: Thick Film; Packaging: Tape and Reel; Voltage Rating (DC): 50V; Termination: SMD/SMT; Features: Moisture Resistant; Series: RC; Number of Terminations: 2; Resistance Tolerance: 1%; Construction: Rectangular; Technology: THICK FILM; Length: 1mm; Width: 0.5mm; Height: 0.32mm; Depth: 0.5mm; RoHS Compliant: Yes; Reach SVHC Compliant: No; Military Standard: Not; Lead Free: Lead Free; ComponentLink1URL: https://datasheet.ciiva.com/11819/0900766b80c66297-11819477.pdf?src-supplier=Rs; ComponentLink1Description: https://datasheet.ciiva.com/11819/0900766b80c66297-11819477.pdf?src-supplier=Rs; ComponentLink2URL: https://datasheet.ciiva.com/7983/1018594-7983502.pdf?src-supplier=Element14; ComponentLink2Description: https://datasheet.ciiva.com/7983/1018594-7983502.pdf?src-supplier=Element14; ComponentLink3URL: https://datasheet.ciiva.com/22747/1018594-22747513.pdf?src-supplier=Element14; ComponentLink3Description: https://datasheet.ciiva.com/22747/1018594-22747513.pdf?src-supplier=Element14; ComponentLink4URL: https://datasheet.ciiva.com/12666/pyu-rc0402-51-rohs-l-6-r-12666741.pdf?src-supplier=Mouser; ComponentLink4Description: https://datasheet.ciiva.com/12666/pyu-rc0402-51-rohs-l-6-r-12666741.pdf?src-supplier=Mouser; ComponentLink5URL: https://datasheet.ciiva.com/7849/1018594-7849869.pdf?src-supplier=Element14; ComponentLink5Description: https://datasheet.ciiva.com/7849/1018594-7849869.pdf?src-supplier=Element14; ComponentLink6URL: https://datasheet.ciiva.com/7849/1018594-7849871.pdf?src-supplier=Element14; ComponentLink6Description: https://datasheet.ciiva.com/7849/1018594-7849871.pdf?src-supplier=Element14; ComponentLink7URL: https://datasheet.ciiva.com/17063/pyu-rc0402-51-rohs-l-6-r-17063193.pdf?src-supplier=Future+Electronics; ComponentLink7Description: https://datasheet.ciiva.com/17063/pyu-rc0402-51-rohs-l-6-r-17063193.pdf?src-supplier=Future+Electronics
R20 = Res: RES TF 30.9K OHM 1% 1/16W 0402; Manufacturer: Stackpole Electronics Inc; Manufacturer Part Number: RMCF0402FT30K9; Power (Watts): 0.063W, 1/16W; Temperature Coefficient: ±100ppm/°C; LatestRevisionDate: 2-Dec-2009; Supplier 1: Digi-Key; Supplier Part Number 1: RMCF0402FT30K9CT-ND; RoHS: RoHS Compliant; Category: Resistors; Stock 1: 6328; Pricing 1: 1=0.04, 10=0.025, 50=0.0138, 100=0.0105, 250=0.0078, 500=0.00576, 1000=0.00384 (USD); Resistance (Ohms): 30.9K; Composition: Thick Film; Features: -; Tolerance: ±1%; Size / Dimension: 0.039" L x 0.020" W (1.00mm x 0.50mm); Height: 0.016" (0.40mm); Number of Terminations: 2; Packaging: Cut Tape (CT); Package / Case: 0402 (1005 Metric); ComponentLink1URL: http://www.seielect.com/Catalog/SEI-RMCF.pdf; ComponentLink1Description: http://www.seielect.com/Catalog/SEI-RMCF.pdf
R21 = Res: RES 10.0K OHM 1/16W 1% 0402 SMD; Manufacturer: Yageo; Manufacturer Part Number: RC0402FR-0710KL; Power (Watts): 0.063W, 1/16W; Temperature Coefficient: ±100ppm/°C; LatestRevisionDate: 2-Dec-2009; Supplier 1: Digi-Key; Supplier Part Number 1: 311-10.0KLRCT-ND; RoHS: RoHS Compliant; Category: Resistors; Stock 1: 5597980; Pricing 1: 10=0.014, 50=0.0104, 100=0.0079, 250=0.00584, 500=0.00432, 1000=0.00288 (USD); Resistance (Ohms): 10K; Composition: Thick Film; Features: -; Tolerance: ±1%; Size / Dimension: 0.039" L x 0.020" W (1.00mm x 0.50mm); Height: 0.014" (0.35mm); Number of Terminations: 2; Packaging: Cut Tape (CT); Package / Case: 0402 (1005 Metric); ComponentLink1URL: http://www.yageo.com/documents/recent/PYu-RC0402_51_RoHS_L_6.pdf; ComponentLink1Description: http://www.yageo.com/documents/recent/PYu-RC0402_51_RoHS_L_6.pdf
U1 = IS-IMX-5.0: Inertial Sense IMX; Manufacturer: Inertial Sense; Supplier 1: Inertial Sense; Supplier Part Number 1: IS-IMX-5
U2 = IS-GPX-1.0: Inertial Sense GPX; Manufacturer: Inertial Sense; Supplier 1: Inertial Sense; Supplier Part Number 1: IS-GPX-1
U3 = VBUS053: ESD SUPPRESS 5.5V 36W 3-Line USB; Manufacturer: Vishay Semiconductors; Breakdown Voltage: 6.5 V; Capacitance: 0.7 pF; Clamping Voltage: 18 V; Operating Voltage: 5.5 V (Min); Supplier 1: Mouser; RoHS: RoHS Compliant; Category: ESD Suppressors; Stock 1: 8176; Pricing 1: 1=1.04, 10=0.918, 50=0.805, 100=0.689, 500=0.574, 1000=0.446, 3000=0.366, 9000=0.335 (AUD); Operating Temperature Range: - 40 C to + 125 C; Package / Case: LLP-75; Packaging: Reel; Series: VBUS053AZ-HAF; Product Category: Transient Voltage Suppressors; RoHS - Mouser: Y; Minimum Order Quantity: 1; Reeling: True; ComponentLink1URL: http://www.vishay.com/docs/81845/vbus053a.pdf; ComponentLink1Description: http://www.vishay.com/docs/81845/vbus053a.pdf; Supplier Part Number 1: 78-VBUS053AZ-HAF
U4 = IG_2.0_LGA: IMX multi-frequency RTK-GNSS Module
U5 = ADP2301: IC BUCK ADJ 1.2A 6TSOT; Manufacturer: Analog Devices Inc; Output Type: Adjustable; Number of Outputs: 1; Voltage - Output: 0.8 V ~ 17 V; Voltage - Input: 3 V ~ 20 V; PWM Type: Current Mode; Frequency - Switching: 1.4MHz; Synchronous Rectifier: No; Supplier 1: Digi-Key; RoHS: RoHS Compliant; Category: Integrated Circuits (ICs); Stock 1: 6699; Pricing 1: 1=3.06, 25=2.4992, 100=2.244, 250=2.04, 500=1.785, 1000=1.53 (USD); Type: Step-Down (Buck); Current - Output: 1.2A; Operating Temperature: -40°C ~ 125°C; Mounting Type: Surface Mount; Package / Case: SOT-23-6 Thin, TSOT-23-6; Packaging: Cut Tape (CT); Supplier Device Package: TSOT-6; ComponentLink1URL: http://www.analog.com/static/imported-files/data_sheets/ADP2300_2301.pdf; ComponentLink1Description: http://www.analog.com/static/imported-files/data_sheets/ADP2300_2301.pdf; Supplier Part Number 1: ADP2301AUJZ-R7CT-ND

## Assembly variants
IS-IG-r2.0.2.0: all parts fitted